# EAGLE design Universalsensor (EAGLE 6.3)
Assembly variants: DHT-22, SHT-21
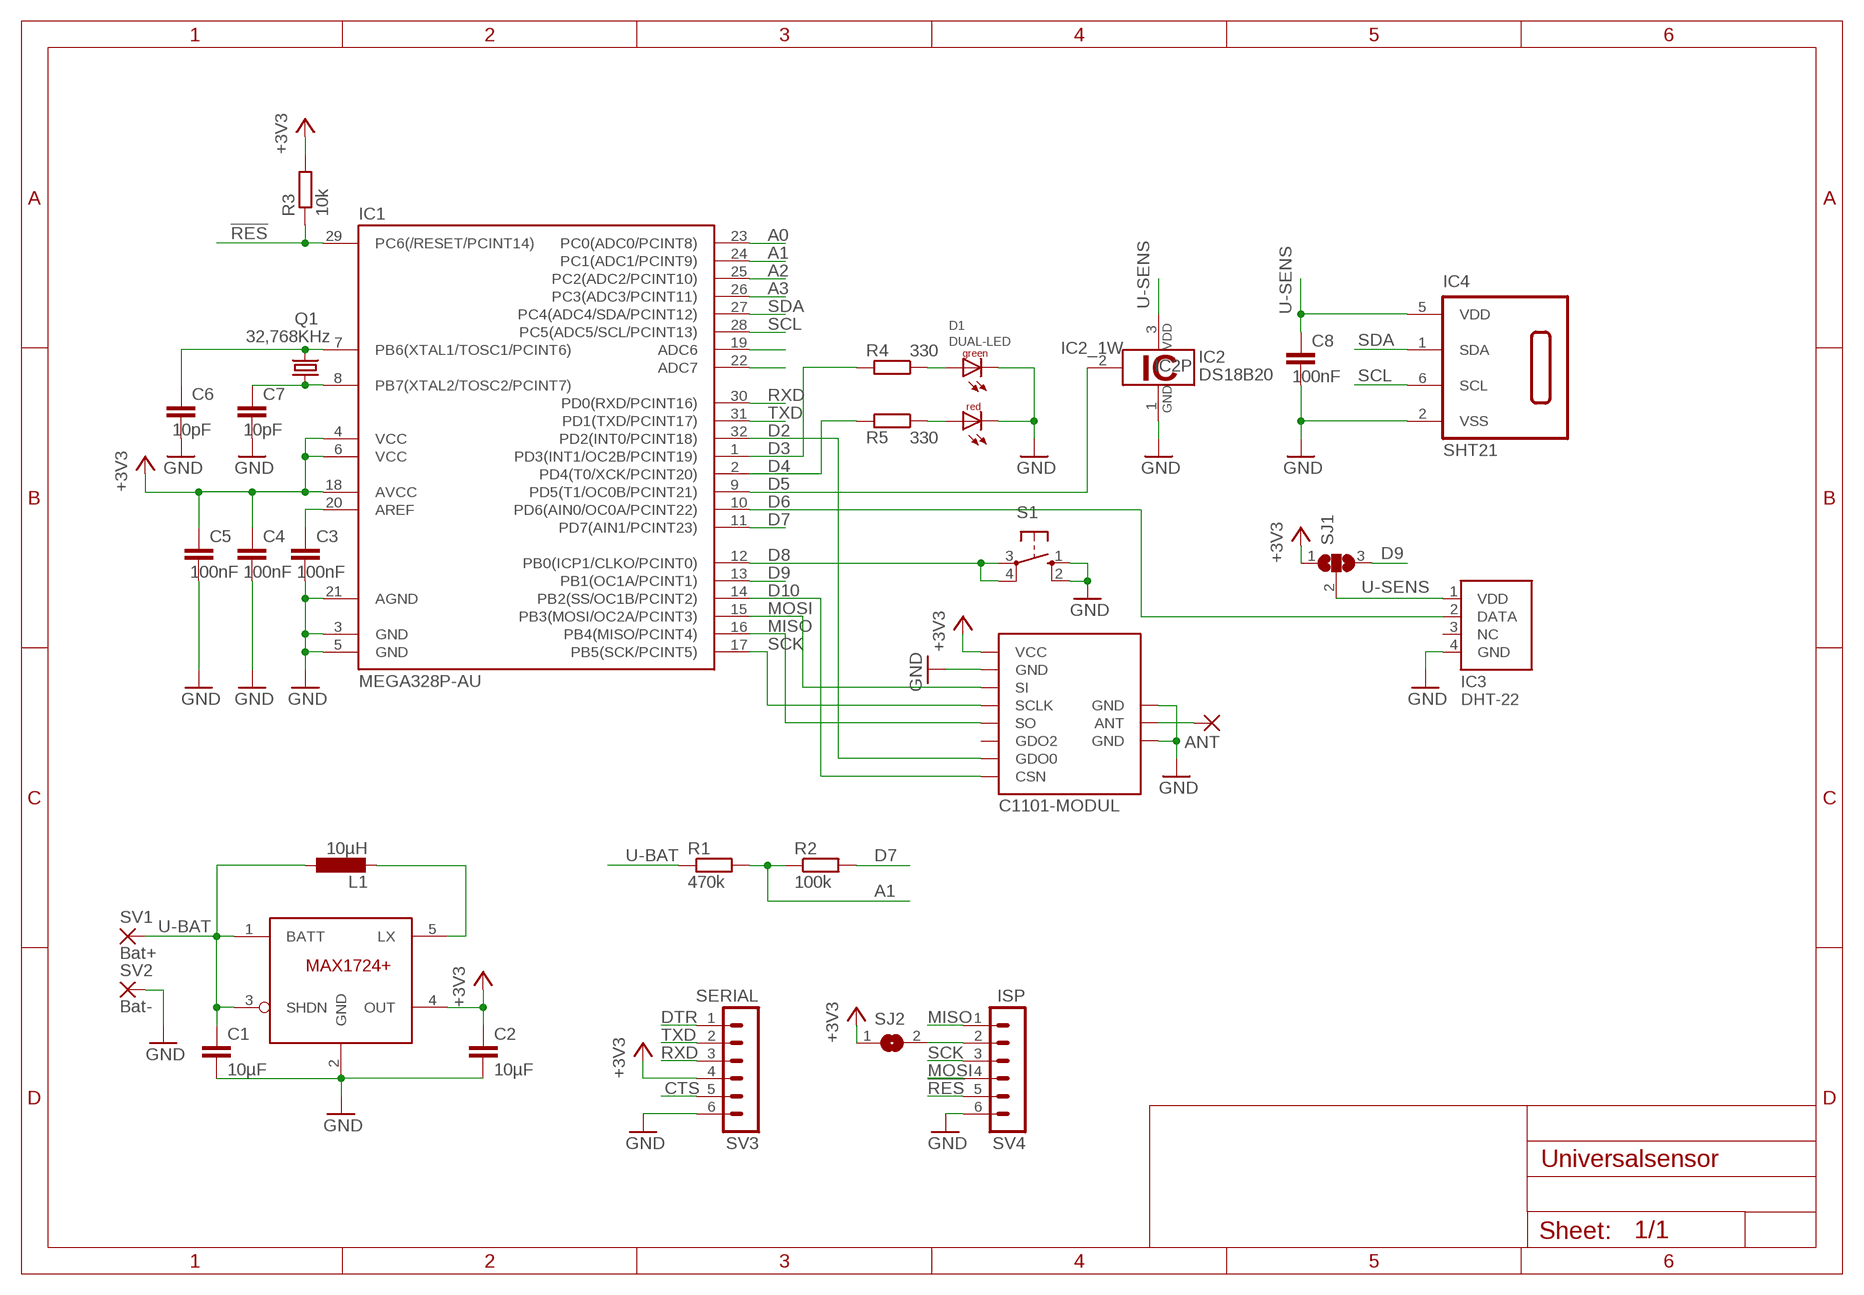
[diagram p0: schematic, sheet 1]

## Parts
ANT  2,54/1,1  [2,54/1,1]
C1  10µF  C-EUC0603K  [C0603K]
C2  10µF  C-EUC0603K  [C0603K]
C3  100nF  C-EUC0603K  [C0603K]
C4  100nF  C-EUC0603K  [C0603K]
C5  100nF  C-EUC0603K  [C0603K]
C6  10pF  C-EUC0603K  [C0603K]  (not fitted in variant DHT-22)  (not fitted in variant SHT-21)
C7  10pF  C-EUC0603K  [C0603K]
C8  100nF  C-EUC0603K  [C0603K]
D1  DUAL-LED  [DUAL-LED]
IC1  MEGA328P-AU  MEGA48/88/168-AU  [TQFP32-08]
IC2  DS18B20  [TO92-]
IC3  DHT-22  [DHT-22-L]  (not fitted in variant SHT-21)
IC4  SHT21  [DFN6/SHT]  (not fitted in variant DHT-22)
IC5  MAX1724  [SOT23-5L]
L1  10µH  L-EUL3230M  [L3230M]
Q1  32,768KHz  OSCILLATOR_32KHZ  [OSCILLATOR_SMD]
R1  470k  R-EU_R0805  [R0805]
R2  100k  R-EU_R0805  [R0805]
R3  10k  R-EU_R0805  [R0805]
R4  330  R-EU_R0805  [R0805]
R5  330  R-EU_R0805  [R0805]
S1  10-XX  [B3F-10XX]
SJ1  SJ2W  [SJ_2]
SJ2  SJ  [SJ]
SV1  Bat+  2,54/1,1  [2,54/1,1]
SV2  Bat-  2,54/1,1  [2,54/1,1]
SV3  SERIAL  MA06-1  [MA06-1]
SV4  ISP  MA06-1  [MA06-1]
U$2  C1101-MODUL  [CC1101-MODUL]

## Nets
!RES: IC1.29(PC6(/RESET/PCINT14)) R3.1 SV4.5
+3V3: C2.1 C4.1 C5.1 IC1.4(VCC) IC1.6(VCC) IC1.18(AVCC) IC5.4(OUT) R3.2 SJ1.1 SJ2.1 SV3.4 U$2.VCC
A0: IC1.23(PC0(ADC0/PCINT8))
A1: IC1.24(PC1(ADC1/PCINT9)) R1.2 R2.1
A2: IC1.25(PC2(ADC2/PCINT10))
A3: IC1.26(PC3(ADC3/PCINT11))
CTS: SV3.5
D2: IC1.32(PD2(INT0/PCINT18)) U$2.GDO0
D3: IC1.1(PD3(INT1/OC2B/PCINT19)) R4.2
D4: IC1.2(PD4(T0/XCK/PCINT20)) R5.2
D5: IC1.9(PD5(T1/OC0B/PCINT21)) IC2.2
D6: IC1.10(PD6(AIN0/OC0A/PCINT22)) IC3.2(DATA)
D7: IC1.11(PD7(AIN1/PCINT23)) R2.2
D8: IC1.12(PB0(ICP1/CLKO/PCINT0)) S1.3(P) S1.4(P1)
D9: IC1.13(PB1(OC1A/PCINT1)) SJ1.3
D10: IC1.14(PB2(SS/OC1B/PCINT2)) U$2.CSN
DTR: SV3.1
GND: C1.2 C2.2 C3.2 C4.2 C5.2 C6.2 C7.2 C8.2 D1.P$3(KG) D1.P$4(KR) IC1.3(GND) IC1.5(GND) IC1.21(AGND) IC2.1 IC3.4(GND) IC4.2(VSS) IC5.2(GND) S1.1(S) S1.2(S1) SV2.1(P) SV3.6 SV4.6 U$2.GND@1(GND) U$2.GND@2(GND) U$2.GND@3(GND)
MISO: IC1.16(PB4(MISO/PCINT4)) SV4.1 U$2.SO
MOSI: IC1.15(PB3(MOSI/OC2A/PCINT3)) SV4.4 U$2.SI
N$1: IC5.5(LX) L1.2
N$2: C3.1 IC1.20(AREF)
N$3: C6.1 IC1.7(PB6(XTAL1/TOSC1/PCINT6)) Q1.2
N$4: D1.P$1(AG) R4.1
N$5: SJ2.2 SV4.2
N$6: D1.P$2(AR) R5.1
N$8: C7.1 IC1.8(PB7(XTAL2/TOSC2/PCINT7)) Q1.1
N$11: ANT.1(P) U$2.ANT
N$12: IC1.19(ADC6)
N$13: IC1.22(ADC7)
RXD: IC1.30(PD0(RXD/PCINT16)) SV3.3
SCK: IC1.17(PB5(SCK/PCINT5)) SV4.3 U$2.SCLK
SCL: IC1.28(PC5(ADC5/SCL/PCINT13)) IC4.6(SCL)
SDA: IC1.27(PC4(ADC4/SDA/PCINT12)) IC4.1(SDA)
TXD: IC1.31(PD1(TXD/PCINT17)) SV3.2
U-BAT: C1.1 IC5.1(BATT) IC5.3(SHDN) L1.1 R1.1 SV1.1(P)
U-SENS: C8.1 IC2.3 IC3.1(VDD) IC4.5(VDD) SJ1.2
Unconnected: IC3.3(NC) U$2.GDO2

## Library data of the parts
ANT SV1 SV2 = wirepad:2,54/1,1: THROUGH-HOLE PAD
C1-C8 = rcl:C-EU: CAPACITOR, European symbol
D1 = Pn-Lib:DUAL-LED
IC1 = avr-7:MEGA48/88/168
IC2 = 1wire:DS18B20: Programmable Resolution Digital Thermometer This chip provides a onewire thermosensor with approx. 0.5°C accuracy. A programmable over/undertemperure alarm is available. The precision can be set from 9..12 bits. Notes: Vdd must be applied for accurate measurements at low temperatures, as the parasite power circuit otherwise heats the sensor. If parasite power is used, Vdd has to be connected to GND. The DS1822 is a low-cost thermometer chip, the DS18S20 is similar to the DS18B20, but with 9 Bit precision only. Author: Jan Kandziora <jjj@gmx.de>
IC3 = Pn-Lib:DHT-22
IC4 = sensirion:SHT21: Humidity and Temperature Sensor
IC5 = MAX1724:MAX1724
L1 = rcl:L-EU: INDUCTOR, European symbol
Q1 = kanflo:OSCILLATOR_32KHZ: CM7V-T1A Tuning Fork Crystal 32.768 kHz
R1-R5 = resistor:R-EU_: RESISTOR, European symbol
S1 = switch-omron:10-XX: OMRON SWITCH; MPN: B3F-1000; OC_FARNELL: 176432; OC_NEWARK: 36M3542
SJ1 = jumper:SJ2W: SMD solder JUMPER
SJ2 = jumper:SJ: SMD solder JUMPER
SV3 SV4 = con-lstb:MA06-1: PIN HEADER; OC_FARNELL: unknown; OC_NEWARK: unknown
U$2 = Pn-Lib:C1101-MODUL

## Board
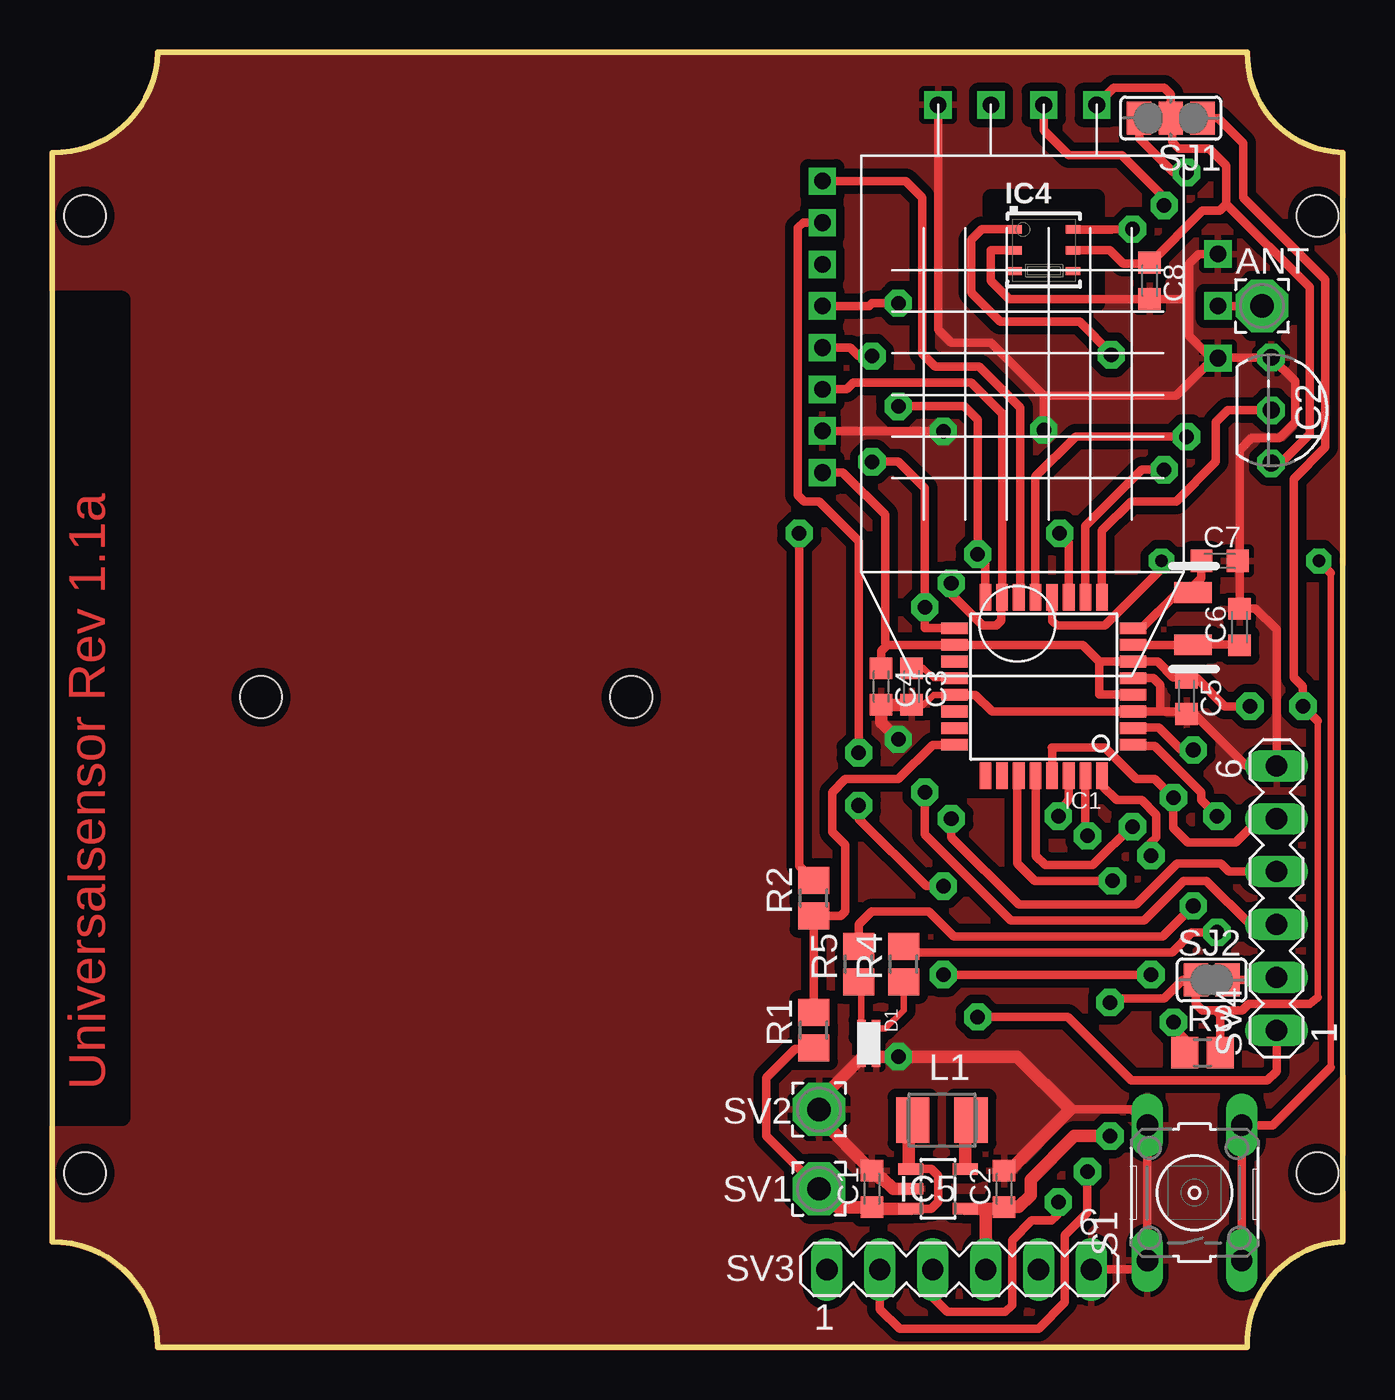
[diagram p1: board, top side]
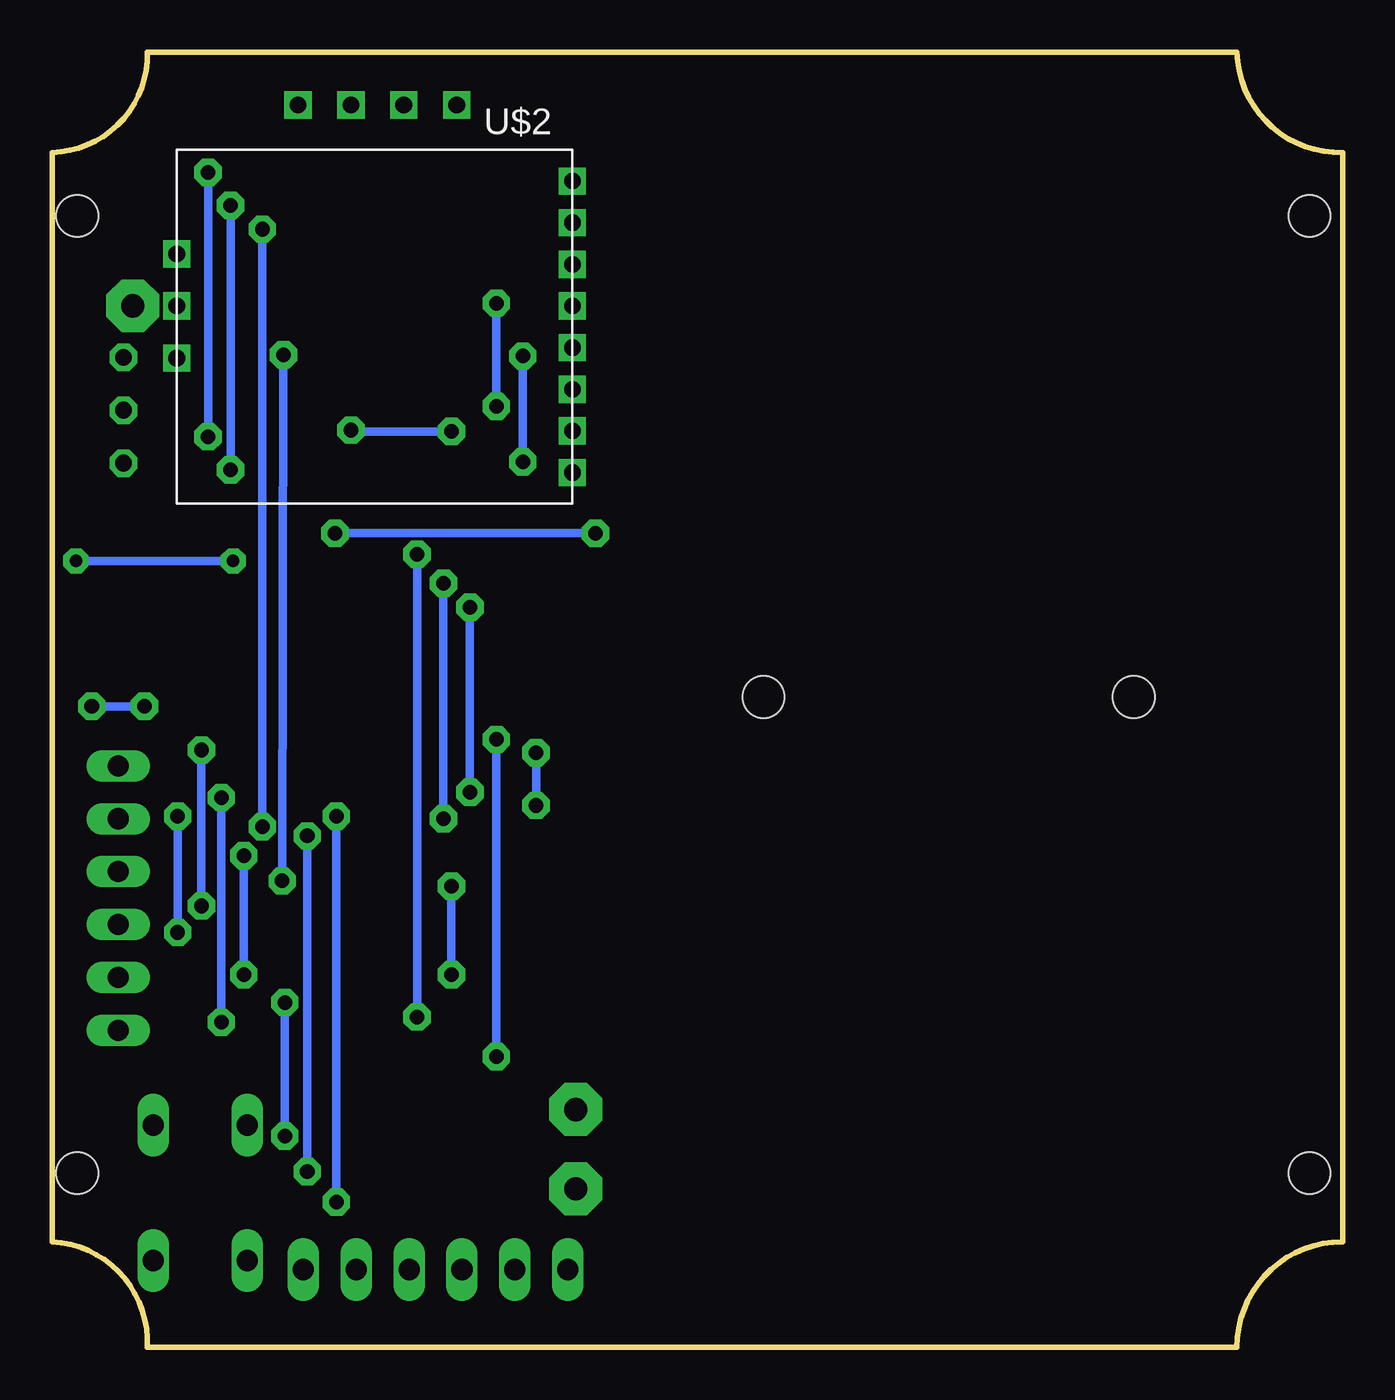
[diagram p2: board, bottom side, seen from below]

Size 61.98 x 62.23 mm. Coordinates in mm from the lower left corner, seen from the top.
Outline: 0,5.08 arc-90 5.08,0 57.4,0 arc-90 61.98,5.08 61.98,57.4 arc-90 57.4,62.23 5.08,62.23 arc-90 0,57.4 0,5.08
Copper layers (1*16): Top 0.035mm / dielectric 1.5mm / Bottom 0.035mm
Design rules "default *": minimum track width 10mil, minimum drill 23mil, track to track 8mil, track to pad 8mil, pad to pad 8mil, via to via 8mil, smd to smd 8mil, copper to edge 0mil, drill to drill 8mil, minimum pad ring 10mil, minimum via ring 12mil, stop-mask expansion 4mil, vias tented up to drill 0mil, thermal gap 10mil
Holes 2 mm at 1.59,8.38 1.59,54.36 60.77,54.36 10.03,31.24 27.81,31.24 60.77,8.38
tKeepout: area 3,0 to 35.1,62.2
tRestrict: area 42.5,26.8 to 52.6,36.7; area 0.2,11 to 3.4,50.4; area 45.1,50.2 to 50.2,55.2

### Footprints (pad centres in the part's own frame; a part is rotated, then mirrored left to right if it is on the bottom)
2,54/1,1 = drill 1.118 pad 2.54 octagon: 1 0,0
C0603K = smd 1.05 x 1.08: 1 -0.875,0; 2 0.875,0
DUAL-LED = smd 0.813 x 0.406: P$1 -0.713,0.201; P$2 -0.713,-0.508; P$3 0.716,0.199; P$4 0.714,-0.509
TQFP32-08 = smd 1.27 x 0.559: 1 -4.293,2.8; 2 -4.293,2; 3 -4.293,1.2; 4 -4.293,0.4; 5 -4.293,-0.4; 6 -4.293,-1.2; 7 -4.293,-2; 8 -4.293,-2.8; 17 4.293,-2.8; 18 4.293,-2; 19 4.293,-1.2; 20 4.293,-0.4; 21 4.293,0.4; 22 4.293,1.2; 23 4.293,2; 24 4.293,2.8 | smd 0.559 x 1.27: 9 -2.8,-4.293; 10 -2,-4.293; 11 -1.2,-4.293; 12 -0.4,-4.293; 13 0.4,-4.293; 14 1.2,-4.293; 15 2,-4.293; 16 2.8,-4.293; 25 2.8,4.293; 26 2,4.293; 27 1.2,4.293; 28 0.4,4.293; 29 -0.4,4.293; 30 -1.2,4.293; 31 -2,4.293; 32 -2.8,4.293
TO92- = drill 0.813 octagon: 1 -2.54,0; 2 0,0; 3 2.54,0
DHT-22-L = drill 0.8 square: 1 -3.81,-11.43; 2 -1.27,-11.43; 3 1.27,-11.43; 4 3.81,-11.43
DFN6/SHT = smd 0.4 x 0.7: 1 -1,-1.4; 2 0,-1.4; 3 1,-1.4; 4 1,1.4; 5 0,1.4; 6 -1,1.4
SOT23-5L = smd 0.55 x 1.2: 1 -0.95,-1.3; 2 0,-1.3; 3 0.95,-1.3; 4 0.95,1.3; 5 -0.95,1.3
L3230M = smd 1.6 x 2.2: 1 -1.4,0; 2 1.4,0
OSCILLATOR_SMD = smd 1 x 1.8: 1 0,0; 2 2.5,0
R0805 = smd 1.3 x 1.5: 1 -0.85,0; 2 0.85,0
B3F-10XX = drill 1.016 long: 1 -3.251,2.261; 2 3.251,2.261; 3 -3.251,-2.261; 4 3.251,-2.261
SJ_2 = smd 1.168 x 1.6: 1 -1.524,0; 2 0,0; 3 1.524,0
SJ = smd 1.168 x 1.6: 1 -0.762,0; 2 0.762,0
MA06-1 = drill 1.016 long: 1 -6.35,0; 2 -3.81,0; 3 -1.27,0; 4 1.27,0; 5 3.81,0; 6 6.35,0
CC1101-MODUL = drill 0.8 square: ANT 9,-0.5; CSN -10,-6.5; GDO0 -10,-4.5; GDO2 -10,-2.5; GND@1 -10,5.5; GND@2 9,2; GND@3 9,-3; SCLK -10,1.5; SI -10,3.5; SO -10,-0.5; VCC -10,7.5

### Placement (x,y rotation side)
ANT  58.1,50.04 0 top
C1  39.37,7.62 90 top
C2  45.72,7.62 90 top
C3  41.27,31.75 270 top
C4  39.81,31.75 270 top
C5  54.48,31.31 270 top
C6  22pF  [C0603K]  57.02,34.61 90 top
C7  22pF  [C0603K]  56.07,37.78 0 top
C8  52.7,51.24 270 top
D1  39.37,14.61 270 top
IC1  47.62,31.75 180 top
IC2  58.55,45.02 270 top
IC3  46.35,48.26 180 top
IC4  47.62,52.7 270 top
IC5  42.55,7.62 270 top
L1  42.74,10.92 0 top
Q1  54.8,36.26 270 top
R1  36.58,15.24 90 top
R2  36.58,21.59 90 top
R3  55.24,14.16 0 top
R4  40.89,18.41 90 top
R5  38.73,18.41 90 top
S1  54.86,7.43 90 top
SJ1  53.72,59.05 180 top
SJ2  55.69,17.65 0 top
SV1  36.83,7.62 0 top
SV2  36.83,11.43 0 top
SV3  43.56,3.75 0 top
SV4  58.8,21.59 90 top
U$2  46.99,49.53 180 bottom

### Tracks (layer width: path | path; a pad name or v marks a point on that pad's centre or on a via)
!RES  (via drill 0.7)
  Top 0.406: IC1.29 48.02,28.81 48.01,28.83 50.55,28.83 52.07,27.3 52.96,27.3 v53.85,26.42 53.85,24.96 54.55,24.26 56.83,24.26 57.98,25.4 SV4.5 | v53.85,15.62 53.85,15.37 54.61,14.61 54.61,14.38 R3.1
  Bottom 0.406: v53.85,15.62 v53.85,26.42
+3V3  (via drill 0.7)
  Top 0.305: 60.77,16.83 60.77,30.1
  Top 0.406: 40.1,33.75 IC1.18 49.5,33.75 50.29,32.96 | 40.1,33.75 39.81,33.47 C4.1 | 50.29,32.96 50.3,32.95 IC1.6 53.09,32.95 53.85,32.19 54.47,32.19 C5.1 54.94,32.18 56.33,30.8 v57.53,30.8 | 50.29,32.96 50.29,31.37 51.9,31.37 IC1.4 | 60.77,16.83 60.39,16.51 57.47,16.51 57.15,16.19 55.88,16.19 | U$2.VCC 37.98,42.03 40.01,40.01 40.01,33.84 40.1,33.75 | 44.83,6.42 45.09,6.67 | SJ1.1 56.01,59.05 57.21,57.85 57.21,55.24 61.15,51.31 61.15,43.24 59.63,41.72 59.63,32.19 60.07,31.75 v60.07,30.8 60.77,30.1 | 55.88,16.19 55.24,16.19 54.93,16.51 SJ2.1 54.29,17.65 53.4,16.76 50.99,16.76 v50.8,16.57 | R3.2 56.09,15.98 55.88,16.19
  Top 0.61: IC5.4 45.09,6.67 45.65,6.67 C2.1 46.43,6.75 46.99,7.3 46.99,8.06 49.09,10.16 v50.8,10.16 | SV3.4 44.83,6.42
  Bottom 0.406: v60.07,30.8 v57.53,30.8 | v50.8,10.16 v50.8,16.57
A1
  Top 0.406: R1.2 R2.1 | IC1.24 42.28,28.95 40.64,27.3 38.1,27.3 37.47,26.67 37.47,24.77 38.1,24.13 38.1,20.95 37.88,20.74 R2.1 | 36.79,20.95 R2.1
D2  (via drill 0.7)
  Top 0.406: IC1.32 50.42,26.98 51.12,26.29 52.32,26.29 53.02,25.59 53.02,24.51 52.77,24.26 v52.77,23.62 | v52.77,17.91 v42.8,17.91 | v38.73,28.57 38.73,38.73 36.83,40.64 36.13,40.64 35.81,40.96 35.81,53.78 36.07,54.04 U$2.GDO0 | v42.8,22.16 41.97,22.16 38.73,25.4 v38.73,26.04
  Bottom 0.406: v52.77,23.62 v52.77,17.91 | v42.8,17.91 v42.8,22.16 | v38.73,28.57 v38.73,26.04
D3  (via drill 0.7)
  Top 0.406: v55.94,19.94 54.74,19.94 53.78,18.99 40.92,18.99 R4.2 | v55.94,25.53 55.18,26.29 55.18,26.67 52.96,28.89 51.98,28.89 IC1.1
  Bottom 0.406: v55.94,19.94 v55.94,25.53
D4  (via drill 0.7)
  Top 0.406: R5.2 38.73,20.32 39.37,20.95 42.1,20.95 43.31,19.75 53.34,19.75 v54.8,21.21 | IC1.2 51.95,29.78 53.15,29.78 54.23,28.7 v54.8,28.7
  Bottom 0.406: v54.8,21.21 v54.8,28.7
D5
  Top 0.406: IC1.9 50.42,39.24 51.82,40.64 53.98,40.64 55.88,42.55 55.88,44.45 56.45,45.02 IC2.2
D6  (via drill 0.7)
  Top 0.406: IC1.10 49.62,39.47 52.32,42.16 v53.4,42.16 | v53.4,54.86 53.4,55.24 51.37,57.28 48.83,57.28 47.62,58.48 IC3.2
  Bottom 0.406: v53.4,42.16 v53.4,54.86
D7  (via drill 0.7)
  Top 0.406: R2.2 35.88,23.14 v35.88,39.12 | IC1.11 48.83,38.68 v48.39,39.12
  Bottom 0.406: v48.39,39.12 v35.88,39.12
D8  (via drill 0.6)
  Top 0.305: 61.4,37.21 61.4,13.46
  Top 0.406: IC1.12 48.02,34.91 48.26,34.67 50.55,34.67 53.28,37.4 v53.28,37.78 | S1.3 S1.4 58.62,10.68 61.4,13.46 | v60.83,37.78 61.4,37.21
  Bottom 0.406: v53.28,37.78 v60.83,37.78
D9  (via drill 0.7)
  Top 0.406: IC1.13 47.23,41.83 49.15,43.75 v54.48,43.75 | v54.48,56.45 53.85,56.45 52.2,58.1 SJ1.3
  Bottom 0.406: v54.48,56.45 v54.48,43.75
D10
  Top 0.406: U$2.CSN 41,56.03 41.78,55.24 41.78,47.75 42.42,47.12 44.51,47.12 46.48,45.15 46.48,36.1 IC1.14
GND  (via drill 0.7)
  Top 0.305: IC1.21 42.34,31.35 41.85,30.86 41.29,30.86 C3.2 | 39.83,30.86 C4.2
  Top 0.406: IC3.4 42.55,48.9 43.18,48.26 45.09,48.26 47.62,45.72 | IC1.21 44.34,31.35 45.15,30.54 IC1.3 53.21,30.55 | 41.26,30.86 C3.2 | 39.65,13.97 D1.P$3 | C2.2 45.96,8.49 | U$2.GND@3 55.07,52.53 54.61,52.07 54.61,50.35 | 54.61,50.35 54.61,48.58 55.66,47.53 U$2.GND@2 | v47.62,44.07 47.62,45.72 | U$2.GND@1 42.77,44.03 v42.8,44.01 | U$2.GND@2 56.02,47.56 IC2.1 59.69,46.42 59.69,44.45 58.93,43.69 57.59,43.69 57.02,43.12 57.02,37.86 C7.2 57.02,37.7 C6.2 57.04,35.5 57.78,35.5 58.8,34.48 SV4.6 57.34,27.94 54.85,30.43 C5.2 54.36,30.55 53.21,30.55 | IC1.5 52.88,32.15 53.21,31.81 53.21,30.55 | SV3.6 52.17,3.75 S1.1 S1.2 51.85,11.43 48.9,11.43 | IC4.2 45.09,52.7 45.09,51.24 45.97,50.35 52.69,50.35 C8.2 54.6,50.37 54.61,50.35 | U$2.GND@2 55.78,47.53 53.98,45.72 47.62,45.72
  Top 0.61: IC5.2 40.39,7.62 39.88,8.13 39.74,8.13 C1.2 36.83,11.04 SV2.1 36.83,11.86 D1.P$4 D1.P$3 | 41.26,30.86 39.83,30.86 39.83,30.02 v40.64,29.21 | 39.65,13.97 v40.64,13.97 46.35,13.97 48.9,11.43 45.96,8.49
  Bottom 0.406: v42.8,44.01 47.43,44.01 v47.62,44.07 | v40.64,29.21 v40.64,13.97
  pour Top (isolate 0.406): 57.4,62.23 5.08,62.23 arc-90 0.19,57.34 0.06,57.34 arc90 0,57.28 0,5.08 arc-90 5.08,0 57.34,0 57.34,0.32 arc-90 61.98,5.14 61.98,57.4 arc-90 57.4,61.98
MISO  (via drill 0.7)
  Top 0.406: IC1.16 44.83,37.73 v44.45,38.1 44.45,44.58 43.81,45.21 v40.64,45.21 | SV4.1 58.8,13.27 58.36,12.83 51.82,12.83 48.77,15.88 v44.45,15.88 | U$2.SO 39.23,50.03 39.37,50.16 v40.64,50.16
  Bottom 0.406: v44.45,38.1 v44.45,15.88 | v40.64,50.16 v40.64,45.21
MOSI  (via drill 0.7)
  Top 0.406: SV4.4 56.52,22.86 56.13,23.24 54.04,23.24 52.07,21.27 46.42,21.27 43.18,24.51 v43.18,25.4 | v43.18,36.7 43.18,36.2 44.7,34.67 45.34,34.67 45.59,34.92 45.59,36.01 IC1.15 45.62,44.86 44.13,46.35 38.48,46.35 38.16,46.04 U$2.SI
  Bottom 0.406: v43.18,25.4 v43.18,36.7
N$1
  Top 0.406: 43.84,10.13 L1.2
  Top 0.61: IC5.5 43.84,10.13
N$2
  Top 0.305: IC1.20 42.34,32.15 41.85,32.64 41.29,32.64 C3.1
N$3
  Top 0.406: IC1.7 Q1.2 57,33.76 C6.1
N$4
  Top 0.305: D1.P$1 40.02,15.32 40.89,16.19 R4.1
N$5
  Top 0.406: SV4.2 57.59,17.78 57.47,17.65 SJ2.2
N$6
  Top 0.305: D1.P$2 38.86,17.44 R5.1
N$8
  Top 0.406: IC1.8 52.33,34.55 53.98,36.2 54.74,36.2 Q1.1 54.8,36.58 55.18,36.96 55.18,37.77 C7.1
N$11
  Top 0.406: U$2.ANT ANT.1
RXD  (via drill 0.7)
  Top 0.406: IC1.30 48.83,26.35 v48.32,25.53 | SV3.3 42.29,2.41 42.99,1.71 45.78,1.71 46.1,2.03 46.1,5.14 47.05,6.1 48.01,6.1 48.26,6.35 48.26,6.92 v48.32,6.99
  Bottom 0.406: v48.32,25.53 v48.32,6.99
SCK  (via drill 0.7)
  Top 0.406: IC1.17 41.91,34.55 v41.91,35.56 41.91,41.27 40.64,42.55 v39.37,42.55 | SV4.3 57.53,20.32 55.44,22.42 54.36,22.42 52.45,20.51 46.04,20.51 41.91,24.64 v41.91,26.67 | U$2.SCLK 38.33,48.03 38.73,47.62 v39.37,47.62
  Bottom 0.406: v39.37,47.62 v39.37,42.55 | v41.91,26.67 v41.91,35.56
SCL  (via drill 0.7)
  Top 0.406: 47.24,27.46 IC1.28 47.24,27.44 47.24,23.62 47.69,23.18 49.97,23.18 50.67,23.88 v51.88,25.02 | IC4.6 50.88,53.7 v51.88,53.72
  Bottom 0.406: v51.88,25.02 v51.88,53.72
SDA  (via drill 0.7)
  Top 0.406: v50.93,22.42 47.18,22.42 46.35,23.24 46.35,27.39 IC1.27 | v50.86,47.69 50.86,47.75 49.34,49.28 45.53,49.28 44.13,50.67 44.13,53.21 44.64,53.72 46.21,53.72 IC4.1
  Bottom 0.406: v50.93,22.42 v50.86,47.69
TXD  (via drill 0.7)
  Top 0.406: SV3.2 39.75,1.84 40.7,0.89 47.37,0.89 48.64,2.16 48.64,5.4 49.72,6.48 v49.72,8.45 | IC1.31 49.62,25.11 v49.72,24.57
  Bottom 0.406: v49.72,24.57 v49.72,8.45
U-BAT
  Top 0.406: SV1.1 34.29,10.16 34.29,12.95 35.69,14.35 36.54,14.35 | IC5.3 42.23,6.67 42.55,6.99 42.55,8.26 42.23,8.57 IC5.1 | 41.15,10.61 L1.1
  Top 0.61: SV1.1 37.72,6.73 39.36,6.73 C1.1 39.45,6.67 IC5.3 | IC5.1 41.15,8.67 41.15,10.61 | 36.54,14.35 R1.1
U-SENS
  Top 0.406: IC3.1 50.99,60.52 53.4,60.52 53.72,60.2 SJ1.2 53.78,58.99 53.78,57.91 54.1,57.59 55.56,57.59 56.39,56.77 56.39,54.93 | 56.39,54.93 60.39,50.93 60.39,43.88 58.99,42.48 IC2.3 | IC4.5 50.8,52.7 51.44,52.07 52.66,52.07 C8.1 52.76,52.12 55.24,54.61 56.07,54.61 56.39,54.93

### Text on the board
Top: Universalsensor Rev 1.1a